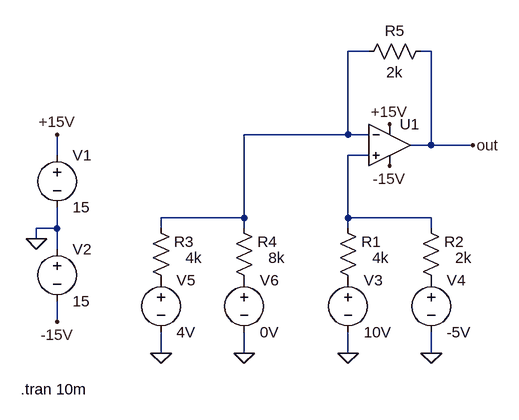
[diagram p0: schematic sim_ex2.asc]
sim_ex2.asc, the LTspice schematic file:
Version 4
SHEET 1 880 680
WIRE 224 -176 192 -176
WIRE 320 -176 304 -176
WIRE 192 -48 192 -176
WIRE 192 -48 32 -48
WIRE 224 -48 192 -48
WIRE 320 -32 320 -176
WIRE 320 -32 288 -32
WIRE 384 -32 320 -32
WIRE -256 -16 -256 -48
WIRE 224 -16 192 -16
WIRE 32 80 32 -48
WIRE 32 80 -96 80
WIRE 192 80 192 -16
WIRE 320 80 192 80
WIRE -256 96 -256 64
WIRE -256 96 -288 96
WIRE -96 96 -96 80
WIRE 32 96 32 80
WIRE 192 96 192 80
WIRE 320 96 320 80
WIRE -288 112 -288 96
WIRE -256 128 -256 96
WIRE -256 240 -256 208
WIRE -96 288 -96 256
WIRE 32 288 32 256
WIRE 192 288 192 256
WIRE 320 288 320 256
FLAG -288 112 0
FLAG -256 -48 +15V
FLAG -256 240 -15V
FLAG 256 -64 +15V
FLAG 256 0 -15V
FLAG 192 288 0
FLAG 320 288 0
FLAG -96 288 0
FLAG 32 288 0
FLAG 384 -32 out
SYMBOL OpAmps\\UniversalOpAmp2 256 -32 R0
SYMATTR InstName U1
SYMBOL voltage -256 -32 R0
WINDOW 123 0 0 Left 0
WINDOW 39 0 0 Left 0
SYMATTR InstName V1
SYMATTR Value 15
SYMBOL voltage -256 112 R0
WINDOW 123 0 0 Left 0
WINDOW 39 0 0 Left 0
SYMATTR InstName V2
SYMATTR Value 15
SYMBOL voltage 192 160 R0
WINDOW 123 0 0 Left 0
WINDOW 39 0 0 Left 0
SYMATTR InstName V3
SYMATTR Value 10V
SYMBOL res 208 192 R180
WINDOW 0 -35 75 Left 2
WINDOW 3 -47 51 Left 2
SYMATTR InstName R1
SYMATTR Value 4k
SYMBOL voltage 320 160 R0
WINDOW 123 0 0 Left 0
WINDOW 39 0 0 Left 0
SYMATTR InstName V4
SYMATTR Value -5V
SYMBOL res 336 192 R180
WINDOW 0 -35 75 Left 2
WINDOW 3 -47 51 Left 2
SYMATTR InstName R2
SYMATTR Value 2k
SYMBOL voltage -96 160 R0
WINDOW 123 0 0 Left 0
WINDOW 39 0 0 Left 0
SYMATTR InstName V5
SYMATTR Value 4V
SYMBOL res -80 192 R180
WINDOW 0 -35 75 Left 2
WINDOW 3 -47 51 Left 2
SYMATTR InstName R3
SYMATTR Value 4k
SYMBOL voltage 32 160 R0
WINDOW 123 0 0 Left 0
WINDOW 39 0 0 Left 0
SYMATTR InstName V6
SYMATTR Value 0V
SYMBOL res 48 192 R180
WINDOW 0 -35 75 Left 2
WINDOW 3 -47 51 Left 2
SYMATTR InstName R4
SYMATTR Value 8k
SYMBOL res 320 -192 R90
WINDOW 0 0 56 VBottom 2
WINDOW 3 32 56 VTop 2
SYMATTR InstName R5
SYMATTR Value 2k
TEXT -312 344 Left 2 !.tran 10m

The netlist it stands for:
* sim_ex2.asc
XU1 N002 N001 +15V -15V out level2 Avol=1Meg GBW=10Meg Slew=10Meg Ilimit=25m Rail=0 Vos=0 En=0 Enk=0 In=0 Ink=0 Rin=500Meg  ; pins In+ In- V+ V- OUT
V1 +15V 0 15
V2 0 -15V 15
V3 P001 0 10V
R1 P001 N002 4k
V4 P002 0 -5V
R2 P002 N002 2k
V5 P003 0 4V
R3 P003 N001 4k
V6 P004 0 0V
R4 P004 N001 8k
R5 out N001 2k
.tran 10m
.lib UniversalOpAmp2.lib
.backanno
.end